# EAGLE design Macro_Duino (EAGLE 7.4.0)
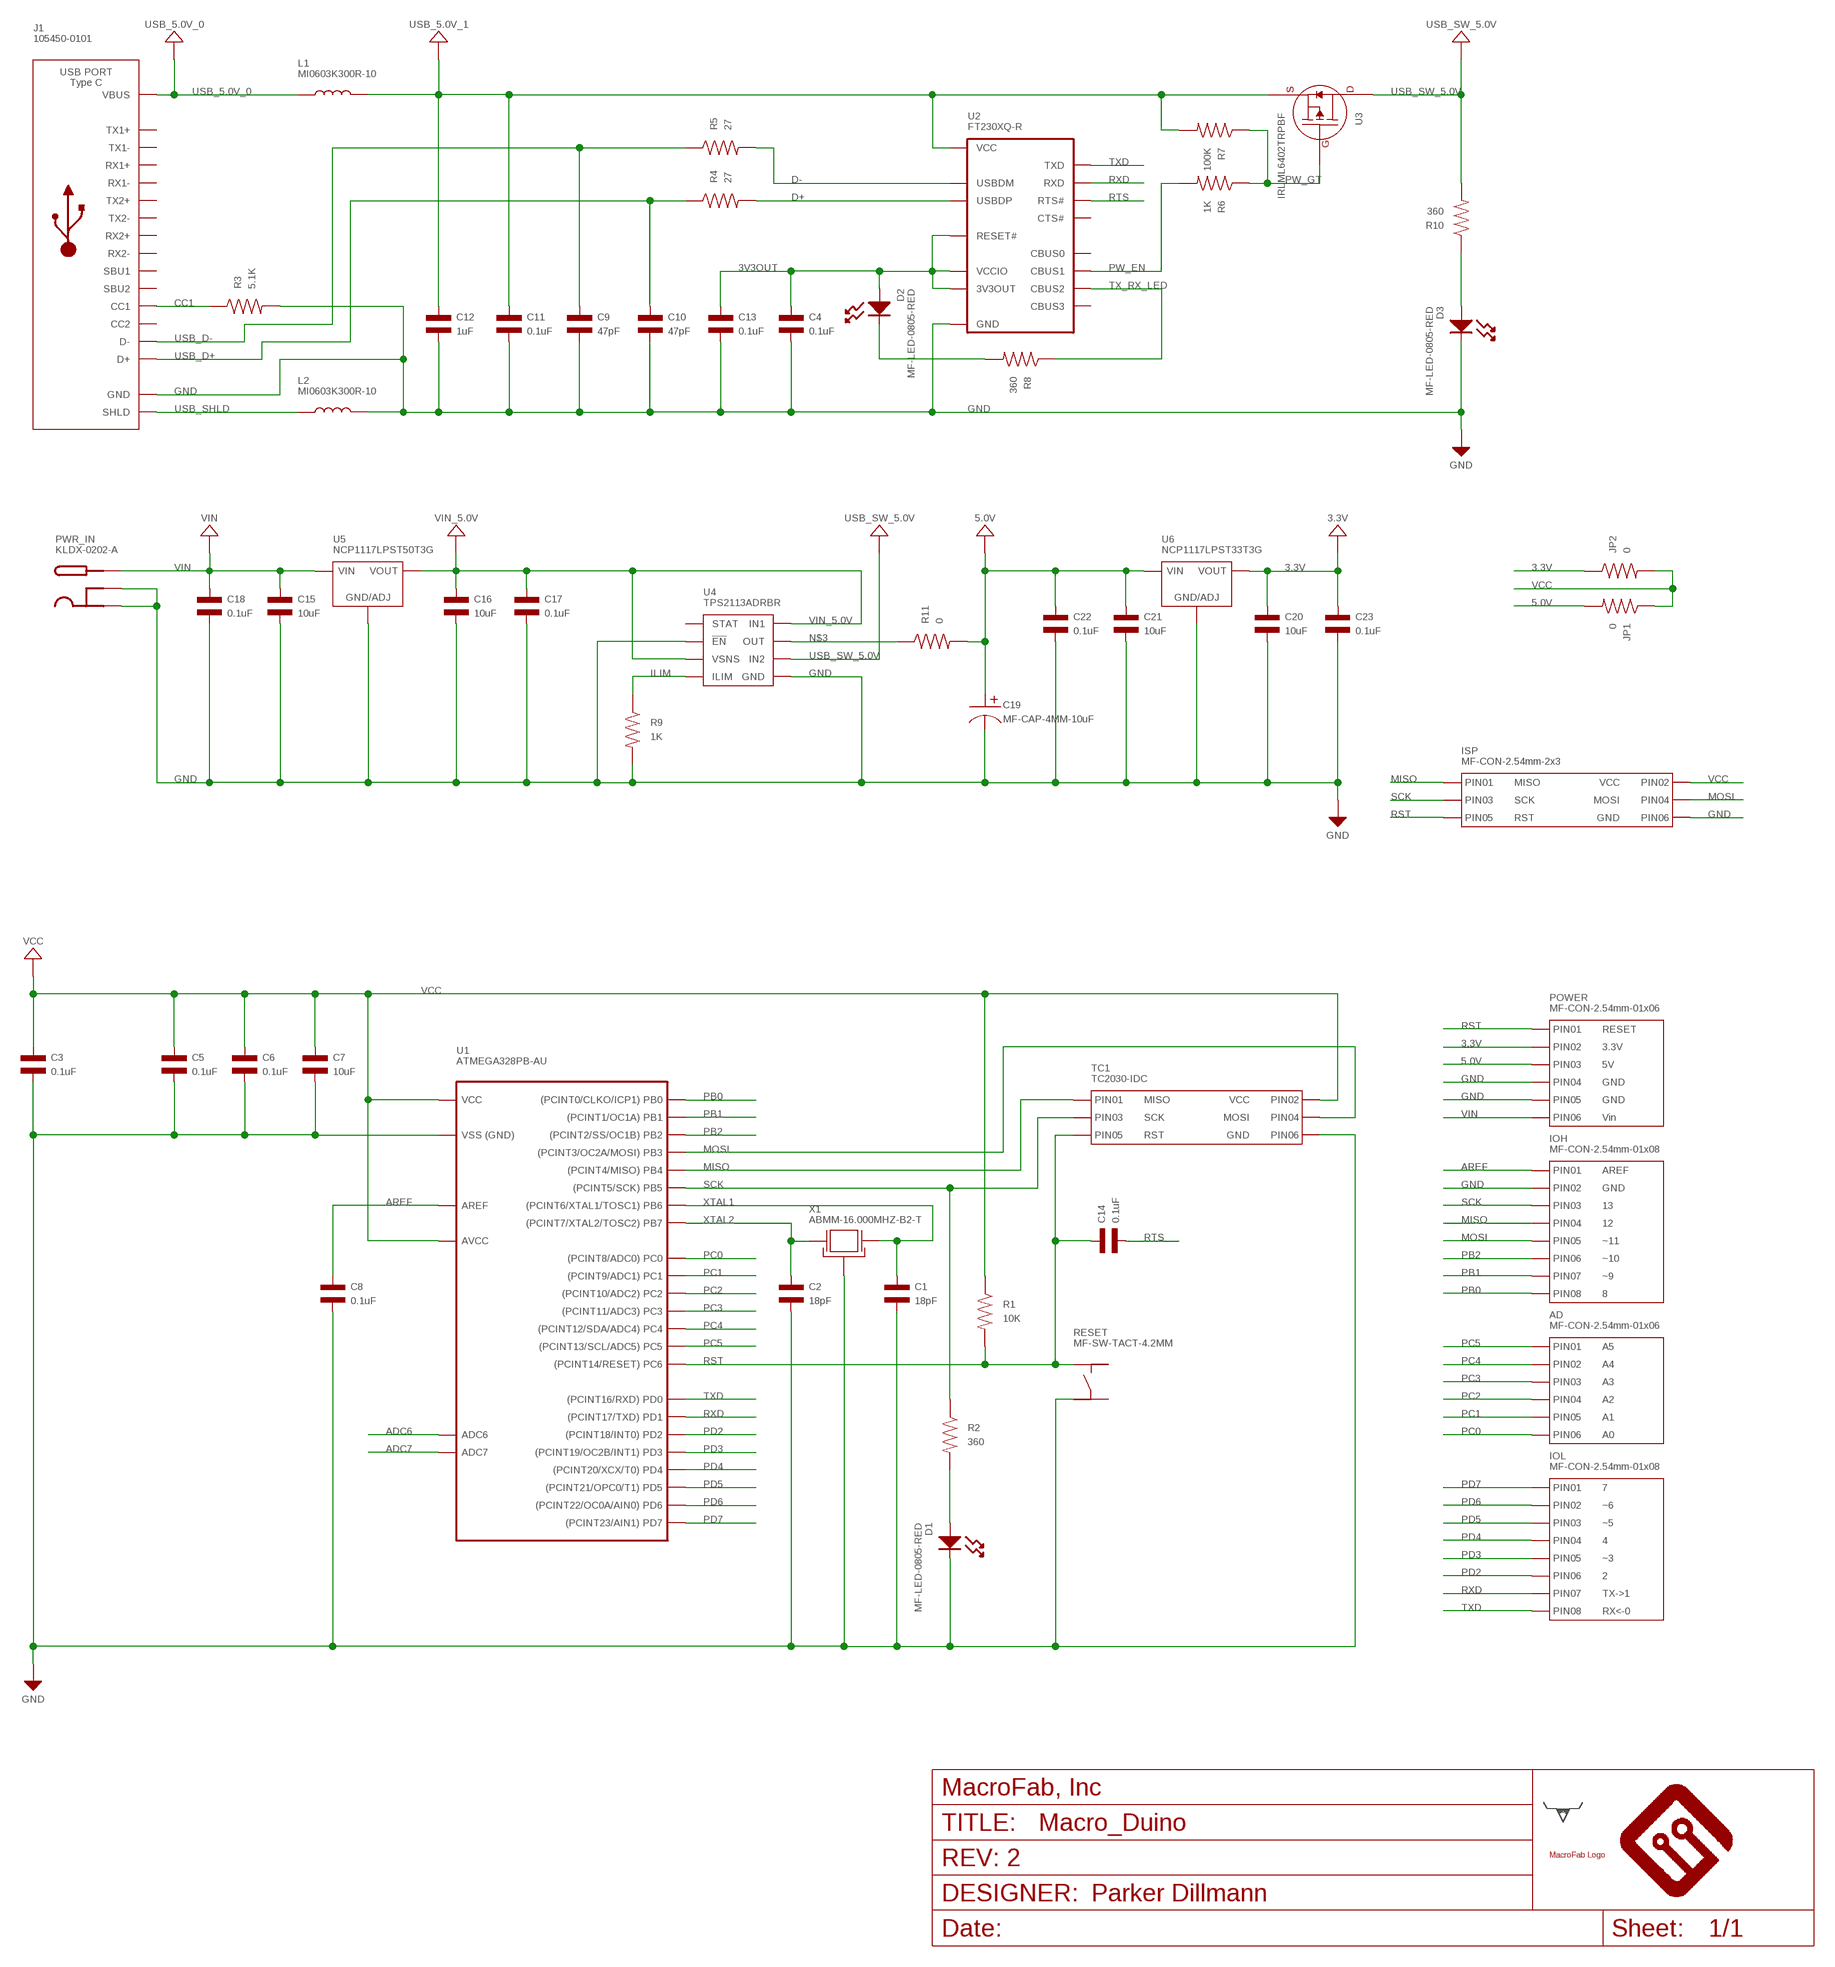
[diagram p0: schematic, sheet 1]

## Parts
AD  MF-CON-2.54mm-01x06  CON_01X06_PTH_2.54MM  [PTH_2.54MM_01X06]
C1  18pF  CAPACITOR_NP_0603  [C0603]
C2  18pF  CAPACITOR_NP_0603  [C0603]
C3  0.1uF  CAPACITOR_NP_0603  [C0603]
C4  0.1uF  CAPACITOR_NP_0603  [C0603]
C5  0.1uF  CAPACITOR_NP_0603  [C0603]
C6  0.1uF  CAPACITOR_NP_0603  [C0603]
C7  10uF  CAPACITOR_NP_1206  [C1206]
C8  0.1uF  CAPACITOR_NP_0603  [C0603]
C9  47pF  CAPACITOR_NP_0603  [C0603]
C10  47pF  CAPACITOR_NP_0603  [C0603]
C11  0.1uF  CAPACITOR_NP_0603  [C0603]
C12  1uF  CAPACITOR_NP_0603  [C0603]
C13  0.1uF  CAPACITOR_NP_0603  [C0603]
C14  0.1uF  CAPACITOR_NP_0603  [C0603]
C15  10uF  CAPACITOR_NP_1206  [C1206]
C16  10uF  CAPACITOR_NP_1206  [C1206]
C17  0.1uF  CAPACITOR_NP_0603  [C0603]
C18  0.1uF  CAPACITOR_NP_0603  [C0603]
C19  MF-CAP-4MM-10uF  CAPACITOR_P_4MM  [CP4MM]
C20  10uF  CAPACITOR_NP_1206  [C1206]
C21  10uF  CAPACITOR_NP_1206  [C1206]
C22  0.1uF  CAPACITOR_NP_0603  [C0603]
C23  0.1uF  CAPACITOR_NP_0603  [C0603]
D1  MF-LED-0805-RED  LED_SINGLE-0805-RED  [LED0805]
D2  MF-LED-0805-RED  LED_SINGLE-0805-RED  [LED0805]
D3  MF-LED-0805-RED  LED_SINGLE-0805-RED  [LED0805]
FRAME1  MF_FRAMEDEFAULT  [MF_FRAME_DEFAULT]
IOH  MF-CON-2.54mm-01x08  CON_01X08_PTH_2.54MM  [PTH_2.54MM_01X08]
IOL  MF-CON-2.54mm-01x08  CON_01X08_PTH_2.54MM  [PTH_2.54MM_01X08]
ISP  MF-CON-2.54mm-2x3  CON_02X03_PTH_2.54MM  [PTH_2.54MM_02X03]
J1  105450-0101  USB_TYPE-C_105450-0101  [105450-0101]
JP1  0  RESISTOR_0805  [R0805]
JP2  0  RESISTOR_0805  [R0805]
L1  MI0603K300R-10  INDUCTOR_0603  [L0603]
L2  MI0603K300R-10  INDUCTOR_0603  [L0603]
POWER  MF-CON-2.54mm-01x06  CON_01X06_PTH_2.54MM  [PTH_2.54MM_01X06]
PWR_IN  KLDX-0202-A  DC_PWR_JACK_2.0MM_RIGHT  [DC_PWR_JACK]
R1  10K  RESISTOR_0603  [R0603]
R2  360  RESISTOR_0603  [R0603]
R3  5.1K  RESISTOR_0603  [R0603]
R4  27  RESISTOR_0603  [R0603]
R5  27  RESISTOR_0603  [R0603]
R6  1K  RESISTOR_0603  [R0603]
R7  100K  RESISTOR_0603  [R0603]
R8  360  RESISTOR_0603  [R0603]
R9  1K  RESISTOR_0603  [R0603]
R10  360  RESISTOR_0603  [R0603]
R11  0  RESISTOR_0805  [R0805]
RESET  MF-SW-TACT-4.2MM  TACT_4.2MM  [TACT4.2MM]
TC1  TC2030-IDC  CON_02X03_AVRISP_TC2030-IDC  [TC2030-IDC-FP]
U1  ATMEGA328PB-AU  ATMEGA328P-AU  [TQFP32]
U2  FT230XQ-R  FT230XQ  [FT230X_QFN-16]
U3  IRLML6402TRPBF  MOSFET_P-CHANNEL_SINGLE_SOT-23  [SOT-23-3]
U4  TPS2113ADRBR  TPS211(2/3)ADR  [TPS211X_SON-8]
U5  NCP1117LPST50T3G  [SOT-223-3]
U6  NCP1117LPST33T3G  [SOT-223-3]
U$14  MF_LOGOLOGO  [MF_LOGO]
U$15  LHE_LOGOLHE_LOGO  [LHE_LOGO]
X1  ABMM-16.000MHZ-B2-T  CYRSTAL_GND_ABMM  [7MMX5MM]

## Nets
3.3V: C20.P$1 C23.P$1 JP2.P$1 POWER.P$2(PIN2) U6.P$1(VOUT) U6.P$3(VOUT)
3V3OUT: C4.P$1 C13.P$1 D2.ANODE U2.1(VCCIO) U2.8(3V3OUT) U2.9(RESET#)
5.0V: C19.P$1 C21.P$1 C22.P$1 JP1.P$2 POWER.P$3(PIN3) R11.P$2 U6.P$4(VIN)
ADC6: U1.P$19(ADC6)
ADC7: U1.P$22(ADC7)
AREF: C8.P$1 IOH.P$1(PIN1) U1.P$20(AREF)
CC1: J1.A5(CC1) R3.P$1
D+: R4.P$2 U2.6(USBDP)
D-: R5.P$2 U2.7(USBDM)
GND: C1.P$2 C2.P$2 C3.P$2 C4.P$2 C5.P$2 C6.P$2 C7.P$2 C8.P$2 C9.P$2 C10.P$2 C11.P$2 C12.P$2 C13.P$2 C15.P$2 C16.P$2 C17.P$2 C18.P$2 C19.P$2 C20.P$2 C21.P$2 C22.P$2 C23.P$2 D1.CATHODE D3.CATHODE IOH.P$2(PIN2) ISP.P$6(PIN6) J1.A1(GND) J1.A12(GND) J1.B1(GND) J1.B12(GND) L2.P$2 POWER.P$4(PIN4) POWER.P$5(PIN5) PWR_IN.SLEEVE1(SLEEVE) PWR_IN.SLEEVE2(SLEEVE_SHUNT) R3.P$2 R9.P$2 RESET.P$3 TC1.P$6(PIN6) U1.P$3(GND) U1.P$5(GND) U1.P$21(GND) U2.3(GND) U2.13(GND) U2.PAD(GND) U4.2(!EN) U4.5(GND) U4.PAD(GND) U5.P$2(GND/ADJ) U6.P$2(GND/ADJ) X1.P$2(GND) X1.P$4(GND)
ILIM: R9.P$1 U4.4(ILIM)
MISO: IOH.P$4(PIN4) ISP.P$1(PIN1) TC1.P$1(PIN1) U1.P$16(PB4)
MOSI: IOH.P$5(PIN5) ISP.P$4(PIN4) TC1.P$4(PIN4) U1.P$15(PB3)
N$1: D3.ANODE R10.P$1
N$2: D1.ANODE R2.P$2
N$3: R11.P$1 U4.7(OUT)
N$4: D2.CATHODE R8.P$2
PB0: IOH.P$8(PIN8) U1.P$12(PB0)
PB1: IOH.P$7(PIN7) U1.P$13(PB1)
PB2: IOH.P$6(PIN6) U1.P$14(PB2)
PC0: AD.P$6(PIN6) U1.P$23(PC0)
PC1: AD.P$5(PIN5) U1.P$24(PC1)
PC2: AD.P$4(PIN4) U1.P$25(PC2)
PC3: AD.P$3(PIN3) U1.P$26(PC3)
PC4: AD.P$2(PIN2) U1.P$27(PC4)
PC5: AD.P$1(PIN1) U1.P$28(PC5)
PD2: IOL.P$6(PIN6) U1.P$32(PD2)
PD3: IOL.P$5(PIN5) U1.P$1(PD3)
PD4: IOL.P$4(PIN4) U1.P$2(PD4)
PD5: IOL.P$3(PIN3) U1.P$9(PD5)
PD6: IOL.P$2(PIN2) U1.P$10(PD6)
PD7: IOL.P$1(PIN1) U1.P$11(PD7)
PW_EN: R6.P$2 U2.11(CBUS1)
PW_GT: R6.P$1 R7.P$1 U3.1(GATE)
RST: C14.P$1 ISP.P$5(PIN5) POWER.P$1(PIN1) R1.P$2 RESET.P$1 TC1.P$5(PIN5) U1.P$29(PC6)
RTS: C14.P$2 U2.16(RTS#)
RXD: IOL.P$7(PIN7) U1.P$31(PD1) U2.2(RXD)
SCK: IOH.P$3(PIN3) ISP.P$3(PIN3) R2.P$1 TC1.P$3(PIN3) U1.P$17(PB5)
TX_RX_LED: R8.P$1 U2.5(CBUS2)
TXD: IOL.P$8(PIN8) U1.P$30(PD0) U2.15(TXD)
USB_5.0V_0: J1.A4(VBUS) J1.A9(VBUS) J1.B4(VBUS) J1.B9(VBUS) L1.P$1
USB_5.0V_1: C11.P$1 C12.P$1 L1.P$2 R7.P$2 U2.10(VCC) U3.2(SOURCE)
USB_D+: C10.P$1 J1.A6(D+) J1.B6(D+) R4.P$1
USB_D-: C9.P$1 J1.A7(D-) J1.B7(D-) R5.P$1
USB_SHLD: J1.S_T1(SHLD) J1.S_T2(SHLD) J1.S_T3(SHLD) J1.S_T4(SHLD) L2.P$1
USB_SW_5.0V: R10.P$2 U3.3(DRAIN) U4.6(IN2)
VCC: C3.P$1 C5.P$1 C6.P$1 C7.P$1 ISP.P$2(PIN2) JP1.P$1 JP2.P$2 R1.P$1 TC1.P$2(PIN2) U1.P$4(VCC) U1.P$6(VCC) U1.P$18(AVCC)
VIN: C15.P$1 C18.P$1 POWER.P$6(PIN6) PWR_IN.PIN U5.P$4(VIN)
VIN_5.0V: C16.P$1 C17.P$1 U4.3(VSNS) U4.8(IN1) U5.P$1(VOUT) U5.P$3(VOUT)
XTAL1: C1.P$1 U1.P$7(PB6) X1.P$3(X1)
XTAL2: C2.P$1 U1.P$8(PB7) X1.P$1(X0)
Unconnected: J1.A2(TX1+) J1.A3(TX1-) J1.A8(SBU1) J1.A10(RX2-) J1.A11(RX2+) J1.B2(TX2+) J1.B3(TX2-) J1.B5(CC2) J1.B8(SBU2) J1.B10(RX1-) J1.B11(RX1+) RESET.P$2 RESET.P$4 U2.4(CTS#) U2.12(CBUS0) U2.14(CBUS3) U4.1(STAT)

## Library data of the parts
AD = MF_Connectors:CON_01X06: Library: MF_Connectors Description: Header Connector with 6 Positions and 01 Rows. Use the LABEL Attribute to label the pin on the schematic and PCB. You can remove the attributes on the PCB by using the SMASH function on the part and then deleting the text.; HOUSEPART: YES; LABEL01: A5; LABEL02: A4; LABEL03: A3; LABEL04: A2; LABEL05: A1; LABEL06: A0; MPN: MF-CON-2.54mm-01x06; POPULATE: 1; URL: https://factory.macrofab.com/part/MF-CON-2.54mm-01x06
C1 C2 = MF_Passives:CAPACITOR_NP: Library: MF_Passives Description: Device for Non-Polarized Capacitors. Manufacture part number (MPN) can be added via Attributes. Check https://factory.macrofab.com/parts for the house parts list.; MPN: VJ0603A180JXACW1BC; POPULATE: 1
C3-C6 C8 C11 C13 C14 C17 C18 C22 C23 = MF_Passives:CAPACITOR_NP: Library: MF_Passives Description: Device for Non-Polarized Capacitors. Manufacture part number (MPN) can be added via Attributes. Check https://factory.macrofab.com/parts for the house parts list.; MPN: MF-CAP-0603-0.1uF; POPULATE: 1
C7 C15 C16 C20 C21 = MF_Passives:CAPACITOR_NP: Library: MF_Passives Description: Device for Non-Polarized Capacitors. Manufacture part number (MPN) can be added via Attributes. Check https://factory.macrofab.com/parts for the house parts list.; MPN: MF-CAP-1206-10uF; POPULATE: 1
C9 C10 = MF_Passives:CAPACITOR_NP: Library: MF_Passives Description: Device for Non-Polarized Capacitors. Manufacture part number (MPN) can be added via Attributes. Check https://factory.macrofab.com/parts for the house parts list.; MPN: 06035A470JAT2A; POPULATE: 1
C12 = MF_Passives:CAPACITOR_NP: Library: MF_Passives Description: Device for Non-Polarized Capacitors. Manufacture part number (MPN) can be added via Attributes. Check https://factory.macrofab.com/parts for the house parts list.; MPN: MF-CAP-0603-1uF; POPULATE: 1
C19 = MF_Passives:CAPACITOR_P: Library: MF_Passives Description: Device for Polarized Capacitors. Manufacture part number (MPN), Voltage Rating, and Tolerance can be added via Attributes. Check https://factory.macrofab.com/parts for the house parts list.; MPN: MF-CAP-4MM-10uF; POPULATE: 1
D1-D3 = MF_LEDs:LED_SINGLE: Library: MF_LEDs Description: Device for Single LED Packages. Manufacture part number (MFG#) can be added via Attributes.; HOUSEPART: YES; MPN: MF-LED-0805-RED; POPULATE: 1; URL: https://factory.macrofab.com/part/MF-LED-0805-RED
FRAME1 = MF_Aesthetics:MF_FRAME: Library: MF_Aesthetics Description: Frame for adding Meta Data to the PCB and Schematic.; DNAME: Parker Dillmann; HOUSEPART: 0; POPULATE: 0; REVNUM: REV: 2
IOH = MF_Connectors:CON_01X08: Library: MF_Connectors Description: Header Connector with 8 Positions and 01 Rows. Use the LABEL Attribute to label the pin on the schematic and PCB. You can remove the attributes on the PCB by using the SMASH function on the part and then deleting the text.; HOUSEPART: YES; LABEL01: AREF; LABEL02: GND; LABEL03: 13; LABEL04: 12; LABEL05: ~11; LABEL06: ~10; LABEL07: ~9; LABEL08: 8; MPN: MF-CON-2.54mm-01x08; POPULATE: 1; URL: https://factory.macrofab.com/part/MF-CON-2.54mm-01x08
IOL = MF_Connectors:CON_01X08: Library: MF_Connectors Description: Header Connector with 8 Positions and 01 Rows. Use the LABEL Attribute to label the pin on the schematic and PCB. You can remove the attributes on the PCB by using the SMASH function on the part and then deleting the text.; HOUSEPART: YES; LABEL01: 7; LABEL02: ~6; LABEL03: ~5; LABEL04: 4; LABEL05: ~3; LABEL06: 2; LABEL07: TX->1; LABEL08: RX<-0; MPN: MF-CON-2.54mm-01x08; POPULATE: 1; URL: https://factory.macrofab.com/part/MF-CON-2.54mm-01x08
ISP = MF_Connectors:CON_02X03: Library: MF_Connectors Description: Header Connector with 6 Positions and 02 Rows. Use the LABEL Attribute to label the pin on the schematic and PCB. You can remove the attributes on the PCB by using the SMASH function on the part and then deleting the text.; HOUSEPART: YES; LABEL01: MISO; LABEL02: VCC; LABEL03: SCK; LABEL04: MOSI; LABEL05: RST; LABEL06: GND; MPN: MF-CON-2.54mm-2x3; POPULATE: 1; URL: https://factory.macrofab.com/part/MF-CON-2.54mm-2x3
J1 = PP_Connectors:USB_TYPE-C; MPN: 105450-0101; POPULATE: 1
JP1 R11 = MF_Passives:RESISTOR: Library: MF_Passives Description: Device for Resistors. Manufacture part number (MPN), Voltage, Tolerance, and Wattage Rating can be added via Attributes. Check https://factory.macrofab.com/parts for the house parts list.; MPN: MF-RES-0805-0; POPULATE: 1
JP2 = MF_Passives:RESISTOR: Library: MF_Passives Description: Device for Resistors. Manufacture part number (MPN), Voltage, Tolerance, and Wattage Rating can be added via Attributes. Check https://factory.macrofab.com/parts for the house parts list.; MPN: MF-RES-0805-0; POPULATE: 0
L1 L2 = MF_Passives:INDUCTOR: Library: MF_Passives Description: Device for Inductors. Manufacture part number (MPN) can be added via Attributes. Check https://factory.macrofab.com/parts for the house parts list.; MPN: MI0603K300R-10; POPULATE: 1
POWER = MF_Connectors:CON_01X06: Library: MF_Connectors Description: Header Connector with 6 Positions and 01 Rows. Use the LABEL Attribute to label the pin on the schematic and PCB. You can remove the attributes on the PCB by using the SMASH function on the part and then deleting the text.; HOUSEPART: YES; LABEL01: RESET; LABEL02: 3.3V; LABEL03: 5V; LABEL04: GND; LABEL05: GND; LABEL06: Vin; MPN: MF-CON-2.54mm-01x06; POPULATE: 1; URL: https://factory.macrofab.com/part/MF-CON-2.54mm-01x06
PWR_IN = MF_Connectors:DC_PWR_JACK: Library: MF_Connectors Description: DC Barrel Power Jack Connector.; HOUSEPART: NO; MPN: KLDX-0202-A; POPULATE: 1; URL: http://www.4uconnector.com/online/object/4udrawing/18741.pdf
R1 = MF_Passives:RESISTOR: Library: MF_Passives Description: Device for Resistors. Manufacture part number (MPN), Voltage, Tolerance, and Wattage Rating can be added via Attributes. Check https://factory.macrofab.com/parts for the house parts list.; MPN: MF-RES-0603-10K; POPULATE: 1
R2 R8 R10 = MF_Passives:RESISTOR: Library: MF_Passives Description: Device for Resistors. Manufacture part number (MPN), Voltage, Tolerance, and Wattage Rating can be added via Attributes. Check https://factory.macrofab.com/parts for the house parts list.; MPN: MF-RES-0603-360; POPULATE: 1
R3 = MF_Passives:RESISTOR: Library: MF_Passives Description: Device for Resistors. Manufacture part number (MPN), Voltage, Tolerance, and Wattage Rating can be added via Attributes. Check https://factory.macrofab.com/parts for the house parts list.; MPN: CR0603-FX-5101ELF; POPULATE: 1
R4 R5 = MF_Passives:RESISTOR: Library: MF_Passives Description: Device for Resistors. Manufacture part number (MPN), Voltage, Tolerance, and Wattage Rating can be added via Attributes. Check https://factory.macrofab.com/parts for the house parts list.; MPN: MF-RES-0603-27; POPULATE: 1
R6 R9 = MF_Passives:RESISTOR: Library: MF_Passives Description: Device for Resistors. Manufacture part number (MPN), Voltage, Tolerance, and Wattage Rating can be added via Attributes. Check https://factory.macrofab.com/parts for the house parts list.; MPN: MF-RES-0603-1K; POPULATE: 1
R7 = MF_Passives:RESISTOR: Library: MF_Passives Description: Device for Resistors. Manufacture part number (MPN), Voltage, Tolerance, and Wattage Rating can be added via Attributes. Check https://factory.macrofab.com/parts for the house parts list.; MPN: MF-RES-0603-100K; POPULATE: 1
RESET = MF_Switches:TACT: Library: MF_Switches Description: Device for Tact Switches. Manufacture part number (MFG#) can be added via Attributes.; HOUSEPART: YES; MPN: MF-SW-TACT-4.2MM; POPULATE: 1; URL: https://factory.macrofab.com/part/MF-SW-TACT-4.2MM
TC1 = MF_Connectors:CON_02X03: Library: MF_Connectors Description: Header Connector with 6 Positions and 02 Rows. Use the LABEL Attribute to label the pin on the schematic and PCB. You can remove the attributes on the PCB by using the SMASH function on the part and then deleting the text.; HOUSEPART: NO; LABEL01: MISO; LABEL02: VCC; LABEL03: SCK; LABEL04: MOSI; LABEL05: RST; LABEL06: GND; MPN: TC2030-IDC; POPULATE: 0; URL: http://www.tag-connect.com/AVRISP
U1 = MF_IC_Digital:ATMEGA328P: Manufacturer Part #: ATMEGA328P Manufacturer: Atmel Description: 8-bit Microcontrollers - MCU 32KB In-system Flash 20MHz 1.8V-5.5V; HOUSEPART: NO; MPN: ATMEGA328PB-AU; POPULATE: 1; URL: http://www.atmel.com/devices/atmega328p.aspx; VALUE: ATMEGA328P-AU
U2 = PP_DigitalIC:FT230X: Manufacturer Part #: FT230X Manufacturer: FTDI Description: USB Interface IC USB to Basic Serial UART IC; MPN: FT230XQ-R
U3 = PP_DiscreteSemi:MOSFET_P-CHANNEL_SINGLE
U4 = PP_PowerIC:TPS211(2/3): Manufacturer Part #: TPS2112 / TPS2113 Manufacturer: Texas Instruments Description: Power Switch ICs - Power Distribution Autoswitching Power Mux; MPN: TPS2113ADRBR
U5 = MF_IC_Power:NCP1117LP: Manufacturer Part #: NCP1117LP Manufacturer: ON Semiconductor Description: LDO Voltage Regulators; HOUSEPART: NO; MPN: NCP1117LPST50T3G; POPULATE: 1; URL: http://www.onsemi.com/pub_link/Collateral/NCP1117LP-D.PDF
U6 = MF_IC_Power:NCP1117LP: Manufacturer Part #: NCP1117LP Manufacturer: ON Semiconductor Description: LDO Voltage Regulators; HOUSEPART: NO; MPN: NCP1117LPST33T3G; POPULATE: 1; URL: http://www.onsemi.com/pub_link/Collateral/NCP1117LP-D.PDF
U$14 = PP_Aesthetics:MF_LOGO
U$15 = PP_Aesthetics:LHE_LOGO
X1 = MF_Frequency_Control:CYRSTAL_GND: Library: MF_Frequency_Control Description: Device for two functional pin Cyrstal Oscillators and a ground.; HOUSEPART: NO; MPN: ABMM-16.000MHZ-B2-T; POPULATE: 1; URL: http://www.abracon.com/Resonators/ABMM.pdf

## Board
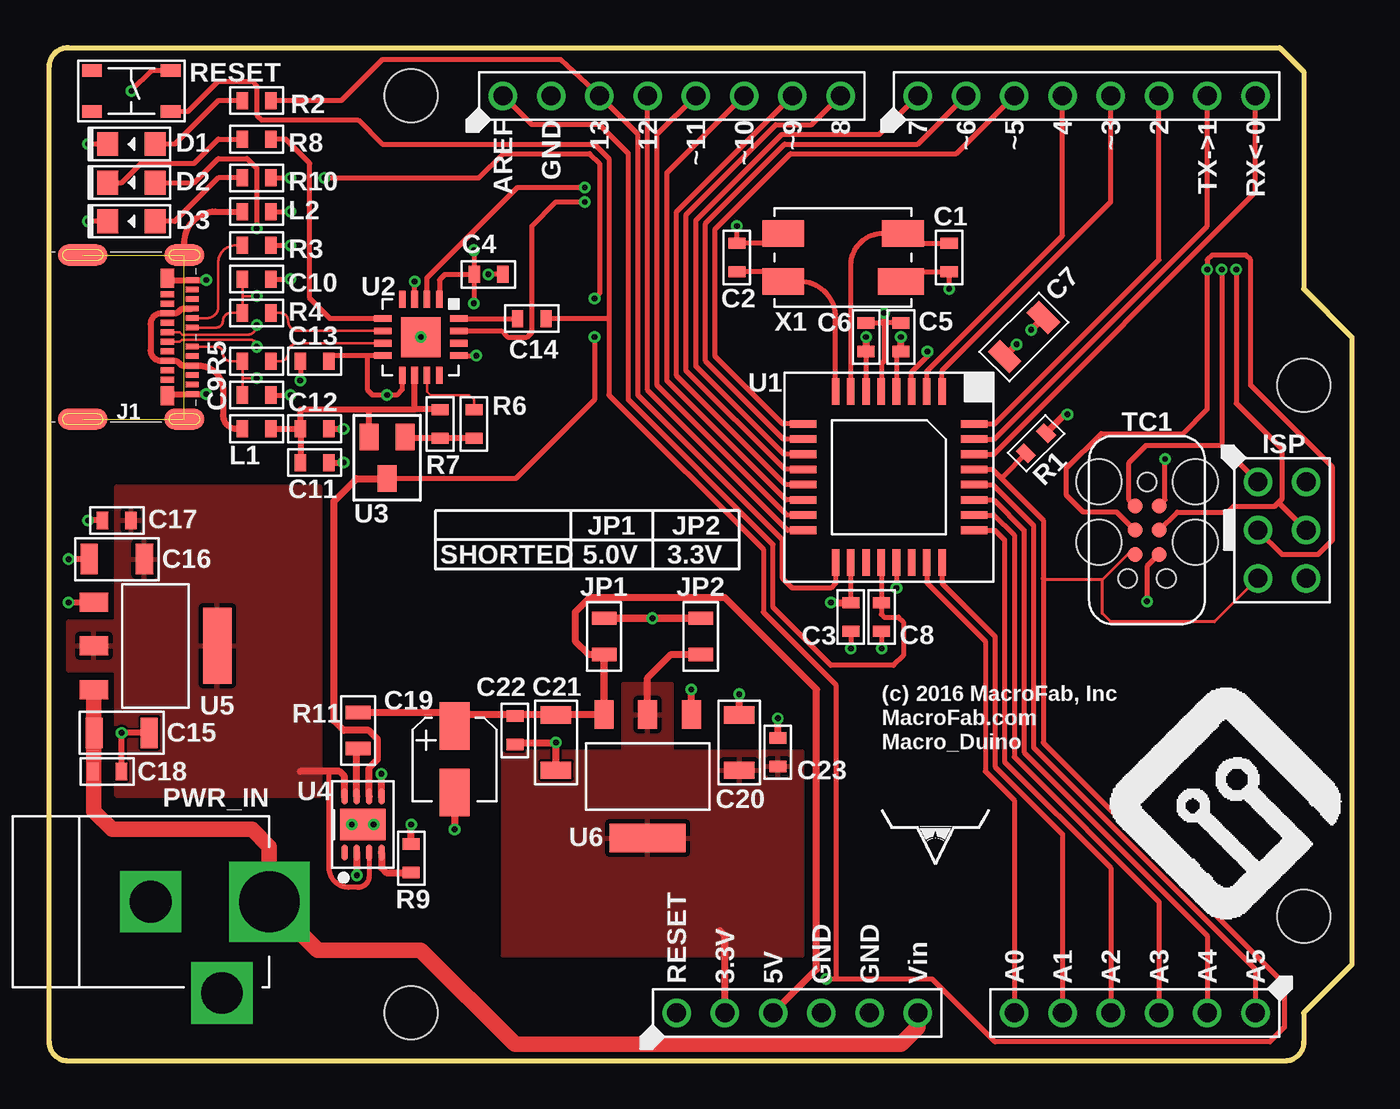
[diagram p1: board, top side]
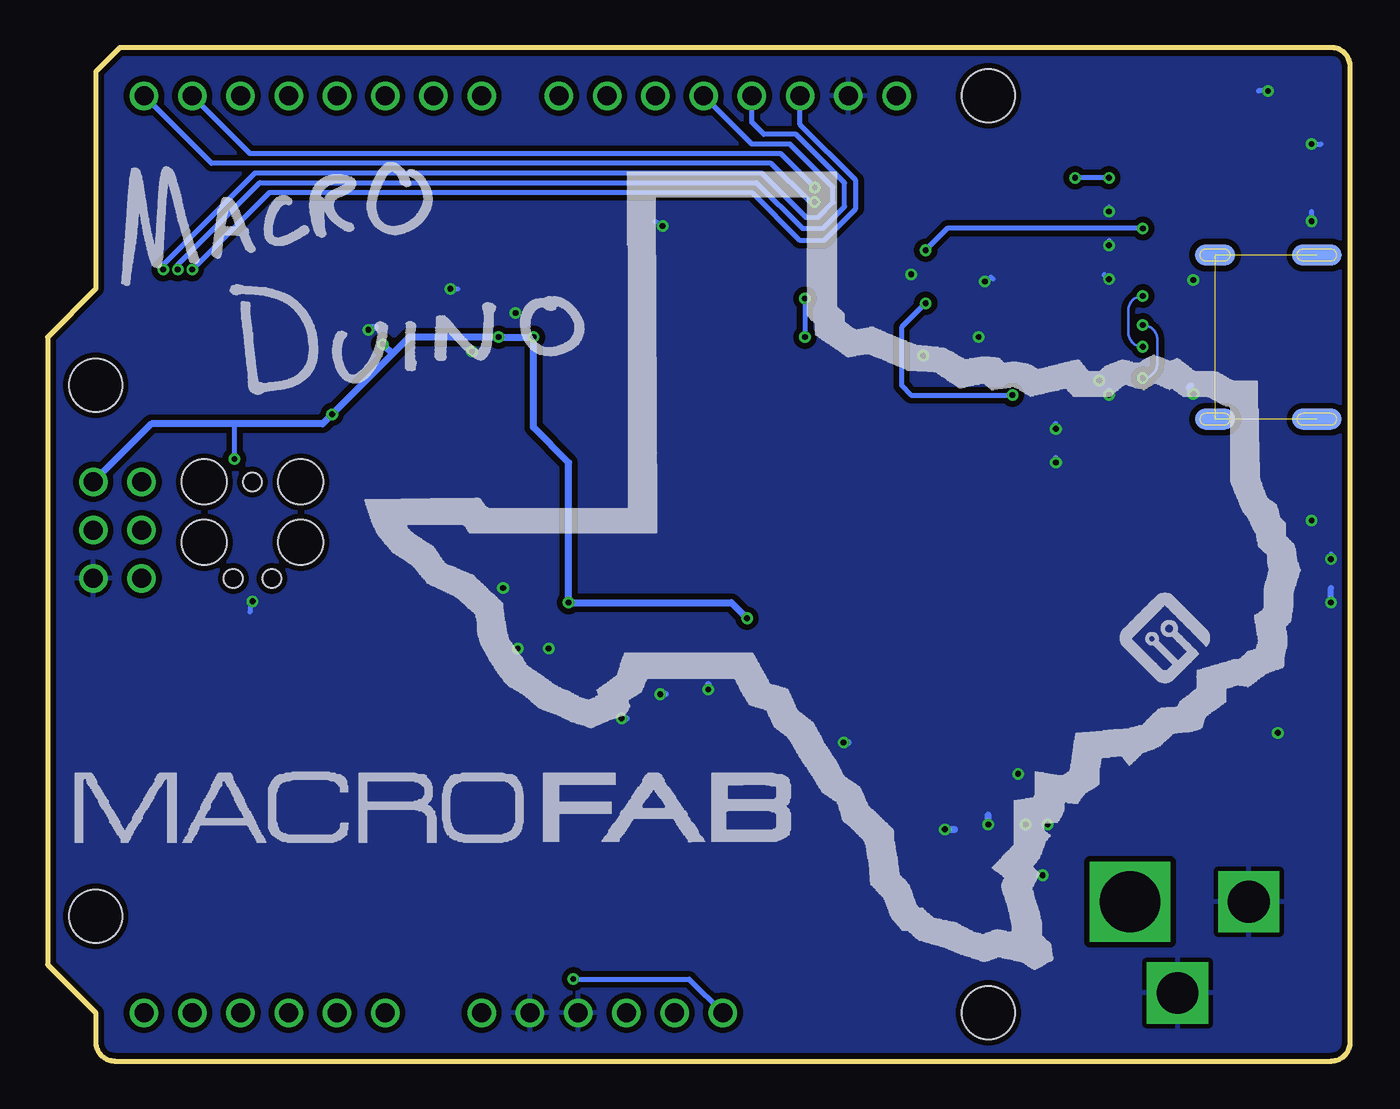
[diagram p2: board, bottom side, seen from below]

Size 68.58 x 53.34 mm. Coordinates in mm from the lower left corner, seen from the top.
Outline: 66.04,2.54 66.04,1 arc-90 65.04,0 1,0 arc-90 0,1 0,52.34 arc-90 1,53.34 64.77,53.34 66.04,52.07 66.04,40.64 68.58,38.1 68.58,5.08 66.04,2.54
Copper layers (1*16): Top 0.035mm / dielectric 1.5mm / Bottom 0.035mm
Design rules "MF_Standard_2_Layer": minimum track width 5mil, minimum drill 12mil, track to track 5mil, track to pad 5mil, pad to pad 5mil, via to via 5mil, smd to smd 0mil, copper to edge 10mil, drill to drill 10mil, minimum pad ring 6mil, minimum via ring 6mil, stop-mask expansion 2mil, vias tented up to drill 25mil, thermal gap 10mil
Holes 2.8 mm at 19.05,50.8 66.04,35.56 66.04,7.62 19.05,2.54

### Footprints (pad centres in the part's own frame; a part is rotated, then mirrored left to right if it is on the bottom)
PTH_2.54MM_01X06 = drill 1: P$1 -6.35,0; P$2 -3.81,0; P$3 -1.27,0; P$4 1.27,0; P$5 3.81,0; P$6 6.35,0
C0603 = smd 0.6 x 0.9: P$1 -0.75,0; P$2 0.75,0
C1206 = smd 0.9 x 1.6: P$1 -1.45,0; P$2 1.45,0
CP4MM = smd 1.6 x 2.5: P$1 0,-1.75; P$2 0,1.75
LED0805 = smd 1.1 x 1.25: ANODE 1.25,0; CATHODE -1.25,0
PTH_2.54MM_01X08 = drill 1: P$1 -8.89,0; P$2 -6.35,0; P$3 -3.81,0; P$4 -1.27,0; P$5 1.27,0; P$6 3.81,0; P$7 6.35,0; P$8 8.89,0
PTH_2.54MM_02X03 = drill 1: P$1 -2.54,-1.27; P$2 -2.54,1.27; P$3 0,-1.27; P$4 0,1.27; P$5 2.54,-1.27; P$6 2.54,1.27
105450-0101 = smd 0.3 x 0.7: A1 -3,0.41; A2 -2.5,0.41; A3 -2,0.41; A4 -1.5,0.41; A5 -1,0.41; A6 -0.5,0.41; A7 0.5,0.41; A8 1,0.41; A9 1.5,0.41; A10 2,0.41; A11 2.5,0.41; A12 3,0.41; B2 2.25,-0.89; B3 1.75,-0.89; B4 1.25,-0.89; B5 0.75,-0.89; B6 0.25,-0.89; B7 -0.25,-0.89; B8 -0.75,-0.89; B9 -1.25,-0.89; B10 -1.75,-0.89; B11 -2.25,-0.89 | smd 1 x 0.7: B1 3.1,-0.89; B12 -3.1,-0.89 | smd 1.1 x 2.6 bottom: S_B1 -4.32,-5.36; S_B4 4.32,-5.36 | smd 1.1 x 2.1 bottom: S_B2 -4.32,0; S_B3 4.32,0 | smd 1.1 x 2.6: S_T1 -4.32,-5.36; S_T4 4.32,-5.36 | smd 1.1 x 2.1: S_T2 -4.32,0; S_T3 4.32,0
R0805 = smd 0.7 x 1.3: P$1 -0.95,0; P$2 0.95,0
L0603 = smd 0.6 x 0.9: P$1 -0.75,0; P$2 0.75,0
DC_PWR_JACK = drill 3.2 square: PIN 6.25,0 | drill 2.2 square: SLEEVE1 0,0; SLEEVE2 3.75,-4.8
R0603 = smd 0.6 x 0.9: P$1 -0.75,0; P$2 0.75,0
TACT4.2MM = smd 1.05 x 0.65: P$1 -2.075,1.075; P$2 2.075,1.075; P$3 -2.075,-1.075; P$4 2.075,-1.075
TC2030-IDC-FP = smd 0.787 x 0.787: P$1 -1.27,-0.635; P$2 -1.27,0.635; P$3 0,-0.635; P$4 0,0.635; P$5 1.27,-0.635; P$6 1.27,0.635 | hole 0.991: 2.54,1.016; 2.54,-1.016; -2.54,0 | hole 2.375: -2.54,2.54; 0.635,2.54; 0.635,-2.54; -2.54,-2.54
TQFP32 = smd 1.4 x 0.4: P$1 -4.5,2.8; P$2 -4.5,2; P$3 -4.5,1.2; P$4 -4.5,0.4; P$5 -4.5,-0.4; P$6 -4.5,-1.2; P$7 -4.5,-2; P$8 -4.5,-2.8; P$17 4.5,-2.8; P$18 4.5,-2; P$19 4.5,-1.2; P$20 4.5,-0.4; P$21 4.5,0.4; P$22 4.5,1.2; P$23 4.5,2; P$24 4.5,2.8 | smd 0.4 x 1.4: P$9 -2.8,-4.5; P$10 -2,-4.5; P$11 -1.2,-4.5; P$12 -0.4,-4.5; P$13 0.4,-4.5; P$14 1.2,-4.5; P$15 2,-4.5; P$16 2.8,-4.5; P$25 2.8,4.5; P$26 2,4.5; P$27 1.2,4.5; P$28 0.4,4.5; P$29 -0.4,4.5; P$30 -1.2,4.5; P$31 -2,4.5; P$32 -2.8,4.5
FT230X_QFN-16 = smd 0.9 x 0.35: 1 -2,0.975; 2 -2,0.325; 3 -2,-0.325; 4 -2,-0.975; 9 2,-0.975; 10 2,-0.325; 11 2,0.325; 12 2,0.975 | smd 0.35 x 0.9: 5 -0.975,-2; 6 -0.325,-2; 7 0.325,-2; 8 0.975,-2; 13 0.975,2; 14 0.325,2; 15 -0.325,2; 16 -0.975,2 | smd 2.1 x 2.1: PAD 0,0
SOT-23-3 = smd 1 x 1.4: 1 -0.95,-1.1; 2 0.95,-1.1; 3 0,1.1
TPS211X_SON-8 = smd 0.35 x 0.85: 1 -0.975,-1.475; 2 -0.325,-1.475; 3 0.325,-1.475; 4 0.975,-1.475; 5 0.975,1.475; 6 0.325,1.475; 7 -0.325,1.475; 8 -0.975,1.475 | smd 2.4 x 1.65: PAD 0,0
SOT-223-3 = smd 1.5 x 4: P$1 3.25,0 | smd 1.5 x 1: P$2 -3.25,2.3; P$3 -3.25,0; P$4 -3.25,-2.3
7MMX5MM = smd 1.4 x 2.2: P$1 -1.27,3.15; P$2 1.27,3.15; P$3 1.27,-3.15 | smd 1.4 x 2.4: P$4 -1.27,-3.05

### Placement (x,y rotation side)
AD  57.15,2.54 180 top
C1  47.37,42.29 270 top
C2  36.2,42.29 90 top
C3  42.2,23.37 270 top
C4  23.11,41.4 0 top
C5  44.83,38.1 90 top
C6  43,38.1 90 top
C7  51.31,38.1 45 top
C8  43.81,23.37 270 top
C9  10.92,35.05 0 top
C10  10.92,41.15 0 top
C11  13.97,31.5 0 top
C12  13.97,33.27 0 top
C13  13.97,36.83 180 top
C14  25.4,39.08 180 top
C15  3.81,17.27 0 top
C16  3.56,26.42 180 top
C17  3.56,28.45 180 top
C18  3.05,15.24 0 top
C19  21.34,15.88 180 top
C20  36.32,16.76 90 top
C21  26.67,16.76 270 top
C22  24.51,17.4 270 top
C23  38.35,16.26 90 top
D1  4.32,48.26 0 top
D2  4.32,46.23 0 top
D3  4.32,44.2 0 top
FRAME1  43.81,20.19 0 top
IOH  32.77,50.8 0 top
IOL  54.61,50.8 0 top
ISP  64.9,27.94 270 top
J1  7.11,38.1 270 top
JP1  29.21,22.35 270 top
JP2  34.29,22.35 90 top
L1  10.92,33.27 0 top
L2  10.92,44.7 0 top
POWER  39.37,2.54 0 top
PWR_IN  5.33,8.38 0 top
R1  51.94,32.51 225 top
R2  10.92,50.55 180 top
R3  10.92,42.93 0 top
R4  10.92,39.37 0 top
R5  10.92,36.83 0 top
R6  22.35,33.53 90 top
R7  20.57,33.53 90 top
R8  10.92,48.51 180 top
R9  19.05,10.67 90 top
R10  10.92,46.48 0 top
R11  16.26,17.4 90 top
RESET  4.32,51.05 180 top
TC1  57.78,27.94 270 top
U1  44.2,30.73 270 top
U2  19.56,38.1 270 top
U3  17.78,31.75 180 top
U4  16.51,12.45 0 top
U5  5.59,21.84 0 top
U6  31.5,14.99 270 top
U$14  55.88,7.49 0 top
U$15  48.64,10.29 0 top
X1  41.78,42.29 90 top

### Tracks (layer width: path | path; a pad name or v marks a point on that pad's centre or on a via)
3.3V
  Top 0.356: POWER.P$2 35.56,6.6 35.31,6.86 | U6.P$3 31.5,20.17 32.73,21.4 JP2.P$1
  pour Top: 23.88,16.26 23.88,5.59 39.62,5.59 39.62,16.26 32.77,16.26 32.77,19.81 30.23,19.81 30.23,16.26
3V3OUT  (via drill 0.3)
  Top 0.254: U2.8 16.76,37.12 | 16.76,37.12 14.72,37.12 C13.P$1 | U2.9 18.58,35.35 18.29,35.05 v17.78,35.05 17.02,35.05 16.76,35.31 16.76,37.12 | U2.1 20.53,41.11 20.83,41.4 C4.P$1 | C4.P$1 v22.35,39.88 | D2.ANODE 7.62,46.23 8.89,47.5 10.41,47.5 10.92,46.99 v10.92,43.81 | v22.35,42.67 22.35,41.41 C4.P$1
  Bottom 0.254: v22.35,39.88 23.62,38.61 23.62,35.56 23.11,35.05 v17.78,35.05 | v10.92,43.81 21.21,43.81 v22.35,42.67
5.0V
  Top 0.356: U6.P$4 26.92,18.24 | 26.92,18.24 24.38,18.24 | 24.38,18.24 21.95,18.24 C19.P$1 21.34,18.35 R11.P$2 | C22.P$1 24.47,18.15 24.38,18.24 | C21.P$1 26.9,18.21 26.92,18.24 | POWER.P$3 40.39,4.83 40.39,19.56 35.56,24.38 28.45,24.38 27.69,23.62 27.69,22.1 28.38,21.4 JP1.P$2
  Top 0.406: U6.P$4 JP1.P$2
AREF
  Top 0.254: C8.P$1 43.81,26.21 U1.P$20 43.8,23.51 43.94,23.37 44.7,23.37 44.96,23.11 44.96,21.34 44.45,20.83 41.15,20.83 38.1,23.88 38.1,27.18 30.48,34.8 30.48,47.75 28.96,49.28 25.4,49.28 IOH.P$1
CC1
  Top 0.127: J1.A5 8.31,39.1 arc90 8.89,39.68 8.89,42.01 arc-90 9.81,42.93 R3.P$1
D+
  Top 0.127: R4.P$2 12.17,39.37 arc-90 12.57,38.97 arc90 13.11,38.42 U2.6
D-
  Top 0.127: R5.P$2 12.13,36.83 arc90 12.57,37.27 arc-90 13.08,37.77 U2.7
GND  (via drill 0.3)
  Top 0.254: C9.P$2 v12.7,35.05 | C10.P$2 v12.7,41.15 | R3.P$2 v12.7,42.93 | L2.P$2 v12.7,44.7 | C13.P$2 v13.22,35.81 v13.21,35.81 | D3.CATHODE v2.03,44.2 | U1.P$21 v44.6,24.89 | C3.P$2 v42.2,21.72 | X1.P$4 44.83,41.54 C1.P$2 v47.37,40.64 | X1.P$2 38.63,43.04 C2.P$2 v36.2,43.94 | C6.P$2 43.94,38.85 | 43.94,38.85 v43.94,39.37 43.94,36.83 43.8,36.68 U1.P$5 | C5.P$2 43.94,38.85 | C8.P$2 v43.81,21.72 | D1.CATHODE v2.03,48.26 | U2.3 v19.23,41.02 | U2.13 v22.48,37.12 | RESET.P$3 5.39,52.13 v4.32,51.05 | U1.P$3 45.4,36.25 46.23,37.08 v46.23,37.34 | v57.78,24.19 57.78,26.04 TC1.P$6 | C4.P$2 v23.11,41.4
  Top 0.305: J1.B12 6.32,41.1 J1.A1 v8.26,41.1 | J1.B1 6.32,35.1 J1.A12 v8.26,35.1 | C11.P$2 v15.49,31.5 | C12.P$2 v15.49,33.27 | U5.P$2 2.32,24.13 v1.02,24.13 | C15.P$2 v3.81,17.27 3.8,17.26 C18.P$2 | C17.P$2 v2.03,28.45 | C16.P$2 v1.02,26.42
  Top 0.356: U4.2 v16.18,9.78 | U4.5 v17.48,15.11 | R9.P$2 v19.05,12.45 | v15.93,12.45 U4.PAD | U6.P$2 v33.8,19.56 | C21.P$2 v26.67,16.76 24.63,16.76 C22.P$2 | C19.P$2 v21.34,12.19 | C20.P$2 v36.32,19.3 | C23.P$2 v38.35,18.03 | C7.P$2 v51.69,38.48
  Bottom 0.254: v12.7,35.05 12.7,35.31 | v12.7,41.15 12.95,41.4 | v12.7,42.93 12.7,43.18 | v12.7,44.7 12.7,44.96 | v2.03,44.2 2.03,44.7 | v36.2,43.94 36.58,44.2 | v47.37,40.64 46.99,40.64 | v2.03,48.26 1.52,48.26 | v19.23,41.02 18.92,41.27 18.8,41.15 | v4.32,51.05 4.83,51.05 | v57.78,24.19 57.91,24.19 57.91,23.62
  Bottom 0.305: 8.51,35.43 8.38,35.56 | v15.49,31.5 15.49,31.75 | v15.49,33.27 15.49,33.53 | v1.02,24.13 1.02,24.89 | v1.02,26.42 1.02,26.67
  Bottom 0.356: v19.05,12.45 19.05,12.95 | v33.8,19.56 33.78,19.81 | v26.67,16.76 26.42,16.76 | v21.34,12.19 20.83,12.19 | v36.32,19.3 36.07,19.3 | v38.35,18.03 38.1,18.03 | v51.69,38.48 51.56,38.61 51.31,38.61
  other vias: 17.07,12.45 19.56,38.1
  pour Bottom (isolate 0.305): 0,0 68.58,0 68.58,53.34 0,53.34
ILIM
  Top 0.356: U4.4 17.48,10.16 17.73,9.92 R9.P$1
MISO  (via drill 0.3)
  Top 0.254: U1.P$16 38.87,27.93 31.5,35.31 IOH.P$4 | TC1.P$1 56.83,29.53 56.83,31.5 57.72,32.38 61.72,32.38 | 61.85,32.26 ISP.P$1 61.72,32.38 | v61.72,41.66 61.72,32.38
  Bottom 0.254: v61.72,41.66 61.72,41.91 57.4,46.23 31.24,46.23 28.84,43.82 27.76,43.82 26.62,44.97 26.62,46.22 29.17,48.77 30.86,48.77 31.5,49.4 IOH.P$4
MOSI  (via drill 0.3)
  Top 0.254: U1.P$15 38.83,28.73 32,35.56 32,48.77 IOH.P$5 | TC1.P$4 59.37,28.89 62.04,28.89 62.36,29.21 64.52,29.21 64.64,29.34 | 64.64,29.34 64.9,29.59 64.9,32.19 62.48,34.61 v62.48,41.66 | ISP.P$4 64.77,29.34 64.64,29.34
  Bottom 0.254: v62.48,41.66 62.48,41.91 57.66,46.74 30.99,46.74 28.66,44.41 28,44.41 27.22,45.18 27.22,45.99 29.49,48.26 31.5,48.26 IOH.P$5
N$1
  Top 0.254: R10.P$1 8.89,46.48 6.6,44.2 D3.ANODE
N$2
  Top 0.254: R2.P$2 8.89,50.55 6.6,48.26 D1.ANODE
N$3
  Top 0.356: U4.7 16.18,16.14 R11.P$1
N$4
  Top 0.254: D2.CATHODE 3.81,46.23 4.83,47.24 7.62,47.24 8.89,48.51 R8.P$2
PB0
  Top 0.254: U1.P$12 38.72,31.13 33.53,36.32 33.53,44.55 38.25,49.28 40.13,49.28 IOH.P$8
PB1
  Top 0.254: U1.P$13 38.75,30.33 33.02,36.07 33.02,44.7 IOH.P$7
PB2
  Top 0.254: U1.P$14 38.79,29.53 32.51,35.81 32.51,46.74 IOH.P$6
PC0
  Top 0.254: AD.P$6 50.8,13.72 49.28,15.24 49.28,22.1 46.2,25.18 U1.P$23
PC1
  Top 0.254: AD.P$5 53.34,11.94 49.78,15.49 49.78,22.35 47,25.14 U1.P$24
PC2
  Top 0.254: U1.P$25 49.79,27.93 50.29,27.43 50.29,15.75 55.88,10.16 AD.P$4
PC3
  Top 0.254: U1.P$26 49.75,28.73 50.8,27.69 50.8,16 58.42,8.38 AD.P$3
PC4
  Top 0.254: U1.P$27 49.71,29.53 51.31,27.94 51.31,16.26 60.96,6.6 AD.P$2
PC5
  Top 0.254: U1.P$28 49.68,30.33 51.82,28.19 51.82,16.51 63.5,4.83 AD.P$1
PD2
  Top 0.254: U1.P$32 49.79,33.53 58.42,42.16 IOL.P$6
PD3
  Top 0.254: U1.P$1 47,36.33 55.88,45.21 IOL.P$5
PD4
  Top 0.254: U1.P$2 46.2,36.29 53.34,43.43 IOL.P$4
PD5
  Top 0.254: U1.P$9 39.63,33.53 39.62,33.53 38.61,33.53 35.05,37.08 35.05,43.78 39.02,47.75 47.75,47.75 IOL.P$3
PD6
  Top 0.254: U1.P$10 38.64,32.73 34.54,36.83 34.54,44.09 38.71,48.26 45.72,48.26 IOL.P$2
PD7
  Top 0.254: U1.P$11 38.68,31.93 34.04,36.58 34.04,44.25 38.56,48.77 43.69,48.77 IOL.P$1
PW_EN
  Top 0.127: U2.11 19.88,35.23 20.07,35.05 22.1,35.05 22.35,34.8 R6.P$2
PW_GT
  Top 0.305: U3.1 arc90 18.8,32.78 R7.P$1 R6.P$1
RST  (via drill 0.3)
  Top 0.127: 52.39,25.34 52.32,25.4
  Top 0.152: TC1.P$5 56.77,26.67 55.44,25.34 | 55.44,25.34 52.39,25.34 | ISP.P$5 61.34,23.11 55.88,23.11 55.44,23.56 55.44,25.34
  Top 0.254: U1.P$29 49.64,31.13 50.16,30.61 | 50.16,30.61 52.32,28.45 52.32,25.4 52.32,16.76 65.02,4.06 65.02,1.78 64.26,1.02 49.78,1.02 46.48,4.32 41.4,4.32 | 41.4,4.32 v40.89,4.32 | RESET.P$1 7.31,49.98 8.89,51.56 10.67,51.56 10.92,51.31 10.92,49.78 11.18,49.53 16.26,49.53 17.53,48.26 28.7,48.26 29.46,47.5 29.46,39.08 | 29.46,39.08 29.46,35.05 37.59,26.92 37.59,23.62 41.4,19.81 41.4,4.32 | 29.46,39.08 C14.P$1 | R1.P$2 50.16,30.73 50.16,30.61
  Bottom 0.254: v40.89,4.32 34.8,4.32 POWER.P$1
RTS
  Top 0.254: U2.16 C14.P$2
RXD  (via drill 0.3)
  Top 0.254: U1.P$31 49.75,32.73 60.96,43.94 IOL.P$7 | U2.2 19.88,41.22 24.64,45.97 v28.19,45.97
  Bottom 0.254: v28.19,45.97 29.97,47.75 57.91,47.75 IOL.P$7
SCK  (via drill 0.3)
  Top 0.254: R2.P$1 15.37,50.55 17.53,52.7 26.92,52.7 IOH.P$3 30.99,48.77 30.99,35.05 38.61,27.43 38.61,25.4 39.12,24.89 41.15,24.89 41.4,25.14 U1.P$17 | TC1.P$3 56.2,28.89 54.43,28.89 53.55,29.77 53.55,31.2 55.37,33.02 59.69,33.02 60.96,34.29 v60.96,41.66 60.96,42.16 61.21,42.42 62.99,42.42 63.25,42.16 63.25,35.56 67.56,31.24 67.56,27.43 66.8,26.67 64.9,26.67 ISP.P$3
  Bottom 0.254: v60.96,41.66 56.9,45.72 31.5,45.72 28.98,43.21 27.67,43.21 26.02,44.86 26.02,46.34 28.96,49.28 IOH.P$3
TX_RX_LED
  Top 0.254: U2.5 14.77,39.08 13.72,40.13 13.72,47.24 12.45,48.51 R8.P$1
TXD  (via drill 0.3)
  Top 0.254: U1.P$30 49.71,31.93 63.5,45.72 IOL.P$8 | U2.15 23.8,38.42 24.13,38.1 25.15,38.1 25.4,38.35 25.4,43.94 26.67,45.21 v28.19,45.21
  Bottom 0.254: v28.19,45.21 28.45,45.21 30.48,47.24 59.94,47.24 IOL.P$8
USB_5.0V_0
  Top 0.305: J1.A4 7.08,39.6 arc45 6.88,39.52 6.8,39.44 arc-45 6.59,39.35 J1.B9 5.88,39.35 arc90 5.33,38.8 5.33,37.4 arc90 5.88,36.85 J1.B4 6.59,36.85 arc-45 6.8,36.76 6.88,36.68 arc45 7.08,36.6 J1.A9 7.86,36.6 arc-90 9.14,35.31 9.14,33.99 arc90 9.86,33.27 L1.P$1
USB_5.0V_1
  Top 0.305: L1.P$2 C12.P$1 | C12.P$1 C11.P$1 | C12.P$1 13.22,34.29 16.83,34.29 | 16.83,34.29 19.23,34.29 | 19.23,34.29 U2.10 | U3.2 16.83,34.29 | R7.P$2 19.23,34.29
USB_D+  (via drill 0.3)
  Top 0.127: J1.A6 8.78,38.6 arc90 9.14,38.97 arc-90 9.55,39.37 R4.P$1 10.17,40.26 | J1.B6 6.86,37.85 6.99,37.97 10.54,37.97 arc-90 v10.92,37.59 | v10.92,40.26 10.17,40.26 | 10.17,40.26 C10.P$1
  Bottom 0.127: v10.92,37.59 arc90 11.68,38.35 11.68,39.5 arc90 v10.92,40.26
USB_D-  (via drill 0.3)
  Top 0.127: J1.A7 8.78,37.6 arc-90 9.14,37.23 arc90 9.55,36.83 R5.P$1 10.17,35.94 | J1.B7 6.85,38.35 arc-90 6.86,38.35 6.99,38.23 10.41,38.23 arc90 v10.92,38.73 | v10.92,35.94 10.17,35.94 | C9.P$1 10.17,35.94
  Bottom 0.127: v10.92,38.73 arc90 10.16,37.97 10.16,36.7 arc90 v10.92,35.94
USB_SHLD  (3 unrouted)
  Top 0.305: J1.S_T2 7.11,43.08 arc-90 8.74,44.7 L2.P$1
USB_SW_5.0V  (via drill 0.3)
  Top 0.254: R10.P$2 v12.7,46.48 | v28.7,38.1 28.7,34.8 24.55,30.65 U3.3 | v14.48,46.48 22.61,46.48 23.88,47.75 28.45,47.75 28.96,47.24 28.96,40.39 v28.7,40.13
  Top 0.356: U4.6 16.84,15.44 17.27,15.88 17.27,16.94 16.81,17.4 15.49,17.4 14.99,17.91 14.99,29.46 16.17,30.65 U3.3
  Bottom 0.254: v12.7,46.48 v14.48,46.48 | v28.7,40.13 v28.7,38.1
VCC  (via drill 0.3)
  Top 0.254: C3.P$1 U1.P$18 | C6.P$1 U1.P$6 | C5.P$1 44.6,37.12 U1.P$4 | TC1.P$2 58.74,29.53 v58.74,31.69
  Top 0.356: C3.P$1 41.16,24.12 v41.15,24.13 | v43,38.1 C6.P$1 | C5.P$1 v44.83,38.1 | R1.P$1 53.47,34.04 v53.59,34.04 | C7.P$1 v50.93,37.72
  Top 0.406: JP2.P$2 v31.75,23.3 JP1.P$1
  Bottom 0.254: v58.74,31.69 58.74,33.53 58.67,33.53
  Bottom 0.356: v31.75,23.3 32.58,24.13 v41.15,24.13 41.15,31.5 43,33.34 v43,38.1 v44.83,38.1 49.53,38.1 50.42,37.21 | 50.42,37.21 v53.59,34.04 54.1,33.53 58.67,33.53 63.12,33.53 ISP.P$2 | v50.93,37.72 50.42,37.21
VIN
  Top 0.305: U5.P$4 2.15,19.35 | 2.34,17.27 C15.P$1 2.36,17.09 2.29,17.02 2.29,15.25 C18.P$1
  Top 0.813: POWER.P$6 45.72,1.78 44.83,0.88 24.52,0.88 19.56,5.84 14.12,5.84 PWR_IN.PIN 11.58,11.28 10.67,12.19 3.3,12.19 2.34,13.16 2.34,17.27 U5.P$4
VIN_5.0V
  Top 0.254: U4.3 16.84,9.72 arc-90 16.26,9.14 15.75,9.14 arc-90 14.73,10.16 14.73,15.24
  Top 0.356: U4.8 15.54,14.98 15.28,15.24 14.73,15.24 13.21,15.24
  pour Top: 3.56,30.23 14.22,30.23 14.22,13.97 3.56,13.97 3.56,20.57 1.02,20.57 1.02,23.11 3.56,23.11
XTAL1
  Top 0.254: U1.P$7 42.2,41.88 arc-90 43.88,43.56 X1.P$3 44.93,43.04 C1.P$1
XTAL2
  Top 0.254: U1.P$8 41.4,39.14 arc90 39.51,41.02 X1.P$1 38.63,41.54 C2.P$1

### Text on the board
tPlace: JP1 | JP2 | SHORTED | 5.0V | 3.3V
bPlace: C:/Users/Parker/Desktop/MacroDuino_Back_silkscreen.bmp